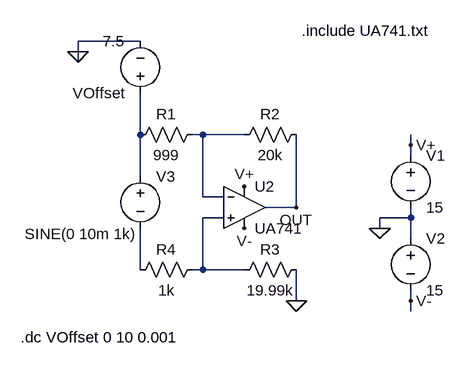
[diagram p0: schematic damp.asc]
damp.asc, the LTspice schematic file:
Version 4.1
SHEET 1 880 680
WIRE -192 -784 -288 -784
WIRE -288 -768 -288 -784
WIRE -288 -752 -288 -768
WIRE -192 -640 -192 -704
WIRE -96 -640 -112 -640
WIRE -32 -640 -96 -640
WIRE 224 -624 224 -640
WIRE 224 -608 224 -624
WIRE -192 -576 -192 -640
WIRE -96 -544 -96 -640
WIRE -64 -544 -96 -544
WIRE 48 -528 48 -640
WIRE 48 -528 0 -528
WIRE -64 -512 -96 -512
WIRE 224 -512 224 -528
WIRE 224 -512 176 -512
WIRE 176 -496 176 -512
WIRE 224 -480 224 -512
WIRE -192 -432 -192 -496
WIRE -96 -432 -96 -512
WIRE -96 -432 -112 -432
WIRE -32 -432 -96 -432
WIRE 48 -384 48 -432
WIRE 224 -384 224 -400
WIRE 224 -368 224 -384
FLAG 176 -496 0
FLAG 224 -624 V+
FLAG 224 -384 V-
FLAG 48 -528 OUT
FLAG -32 -560 V+
FLAG -32 -496 V-
FLAG 48 -384 0
FLAG -288 -768 0
SYMBOL voltage 224 -624 R0
WINDOW 123 0 0 Left 2
WINDOW 39 0 0 Left 2
SYMATTR InstName V1
SYMATTR Value 15
SYMBOL voltage 224 -496 R0
WINDOW 123 0 0 Left 2
WINDOW 39 0 0 Left 2
SYMATTR InstName V2
SYMATTR Value 15
SYMBOL Opamps\\opamp2 -32 -592 R0
SYMATTR InstName U2
SYMATTR Value UA741
SYMBOL res -96 -656 R90
WINDOW 0 0 56 VBottom 2
WINDOW 3 32 56 VTop 2
SYMATTR InstName R1
SYMATTR Value 999
SYMATTR SpiceLine tol=5
SYMBOL res 64 -656 R90
WINDOW 0 0 56 VBottom 2
WINDOW 3 32 56 VTop 2
SYMATTR InstName R2
SYMATTR Value 20k
SYMATTR SpiceLine tol=5
SYMBOL res 64 -448 R90
WINDOW 0 0 56 VBottom 2
WINDOW 3 32 56 VTop 2
SYMATTR InstName R3
SYMATTR Value 19.99k
SYMATTR SpiceLine tol=5
SYMBOL res -96 -448 R90
WINDOW 0 0 56 VBottom 2
WINDOW 3 32 56 VTop 2
SYMATTR InstName R4
SYMATTR Value 1k
SYMATTR SpiceLine tol=5
SYMBOL voltage -192 -592 R0
WINDOW 3 -178 105 Left 2
WINDOW 123 0 0 Left 2
WINDOW 39 0 0 Left 2
SYMATTR Value SINE(0 10m 1k)
SYMATTR InstName V3
SYMBOL voltage -192 -688 R180
WINDOW 123 0 0 Left 2
WINDOW 39 0 0 Left 2
SYMATTR InstName VOffset
SYMATTR Value 7.5
TEXT 56 -800 Left 2 !.include UA741.txt
TEXT -376 -328 Left 2 !.dc VOffset 0 10 0.001

The netlist it stands for:
* damp.asc
V1 V+ 0 15
V2 0 V- 15
X§U2 N003 N002 V+ V- OUT UA741  ; pins In+ In- V+ V- OUT
R1 N002 N001 999 tol=5
R2 OUT N002 20k tol=5
R3 0 N003 19.99k tol=5
R4 N003 N004 1k tol=5
V3 N001 N004 SINE(0 10m 1k)
VOffset N001 0 7.5
.include UA741.txt
.dc VOffset 0 10 0.001
.backanno
.end